# EAGLE schematic Reference (EAGLE 9.6.2)
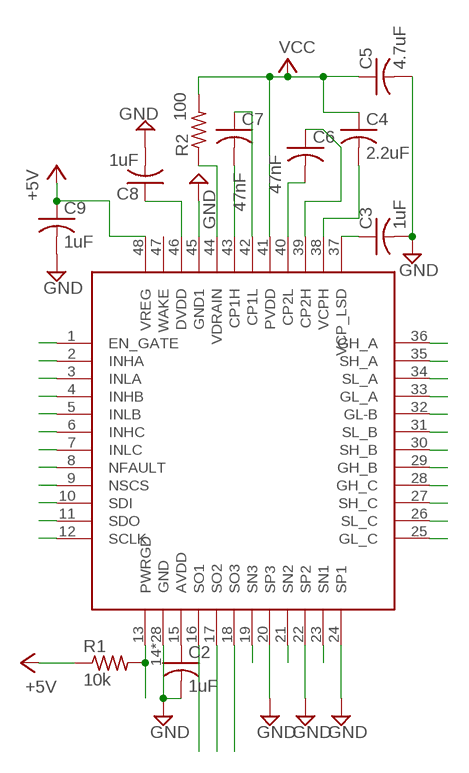
[diagram p0: schematic, sheet 1]

## Parts
C2  1uF  C-USC0603  [C0603]
C3  1uF  C-USC0603  [C0603]
C4  2.2uF  C-USC0603  [C0603]
C5  4.7uF  C-USC0603  [C0603]
C6  47nF  C-USC0603  [C0603]
C7  47nF  C-USC0603  [C0603]
C8  1uF  C-USC0603  [C0603]
C9  1uF  C-USC0603  [C0603]
R1  10k  R-US_R0603  [R0603]
R2  100  R-US_R0603  [R0603]
U$1  DRV8305  [PFB_S-PQFP-G48]

## Nets
+5V: C9.1 R1.1 U$1.48(VREG)
A0: U$1.16(SO1)
A1: U$1.17(SO2)
A2: U$1.18(SO3)
D2: U$1.1(EN_GATE)
D3: U$1.2(INHA)
D4: U$1.8(NFAULT)
D5: U$1.4(INHB)
D6: U$1.6(INHC)
D7: R1.2 U$1.13(PWRGD)
D10: U$1.9(NSCS)
D11: U$1.10(SDI)
D12: U$1.11(SDO)
D13: U$1.12(SCLK)
GH_A: U$1.36(GH_A)
GH_B: U$1.29(GH_B)
GH_C: U$1.28(GH_C)
GL_A: U$1.33(GL_A)
GL_B: U$1.32(GL-B)
GL_C: U$1.25(GL_C)
GND: C2.2 C3.2 C5.2 C8.2 C9.2 U$1.14(GND) U$1.20(SP3) U$1.22(SP2) U$1.24(SP1) U$1.45(GND1) U$1.P$1(GND) U$1.P$2(GND) U$1.P$3(GND) U$1.P$4(GND) U$1.P$5(GND) U$1.P$6(GND) U$1.P$7(GND) U$1.P$8(GND) U$1.P$9(GND) U$1.P$10(GND) U$1.P$11(GND) U$1.P$12(GND) U$1.P$13(GND) U$1.P$14(GND) U$1.P$15(GND) U$1.P$16(GND) U$1.P$17(GND) U$1.P$18(GND) U$1.P$19(GND) U$1.P$20(GND) U$1.P$21(GND) U$1.P$22(GND) U$1.P$23(GND) U$1.P$24(GND) U$1.P$25(GND) U$1.P$26(GND) U$1.P$27(GND)
N$1: C2.1 U$1.15(AVDD)
N$2: C3.1 U$1.37(VCP_LSD)
N$3: C4.2 U$1.38(VCPH)
N$4: C6.2 U$1.40(CP2L)
N$5: C6.1 U$1.39(CP2H)
N$6: C7.2 U$1.43(CP1H)
N$7: C7.1 U$1.42(CP1L)
N$8: R2.1 U$1.44(VDRAIN)
N$9: C8.1 U$1.46(DVDD)
N$10: U$1.3(INLA)
N$11: U$1.5(INLB)
N$12: U$1.7(INLC)
SH_A: U$1.35(SH_A)
SH_B: U$1.30(SH_B)
SH_C: U$1.27(SH_C)
SL_A: U$1.23(SN1) U$1.34(SL_A)
SL_B: U$1.21(SN2) U$1.31(SL_B)
SL_C: U$1.19(SN3) U$1.26(SL_C)
VCC: C4.1 C5.1 R2.2 U$1.41(PVDD)
Unconnected: U$1.47(WAKE)

## Library data of the parts
C2-C9 = rcl:C-US: CAPACITOR, American symbol; SPICEPREFIX: C
R1 R2 = rcl:R-US_: RESISTOR, American symbol; SPICEPREFIX: R
U$1 = BLDC project:DRV8305